# Altium project MMB_Controller.PrjPcb (part 1 of 4)
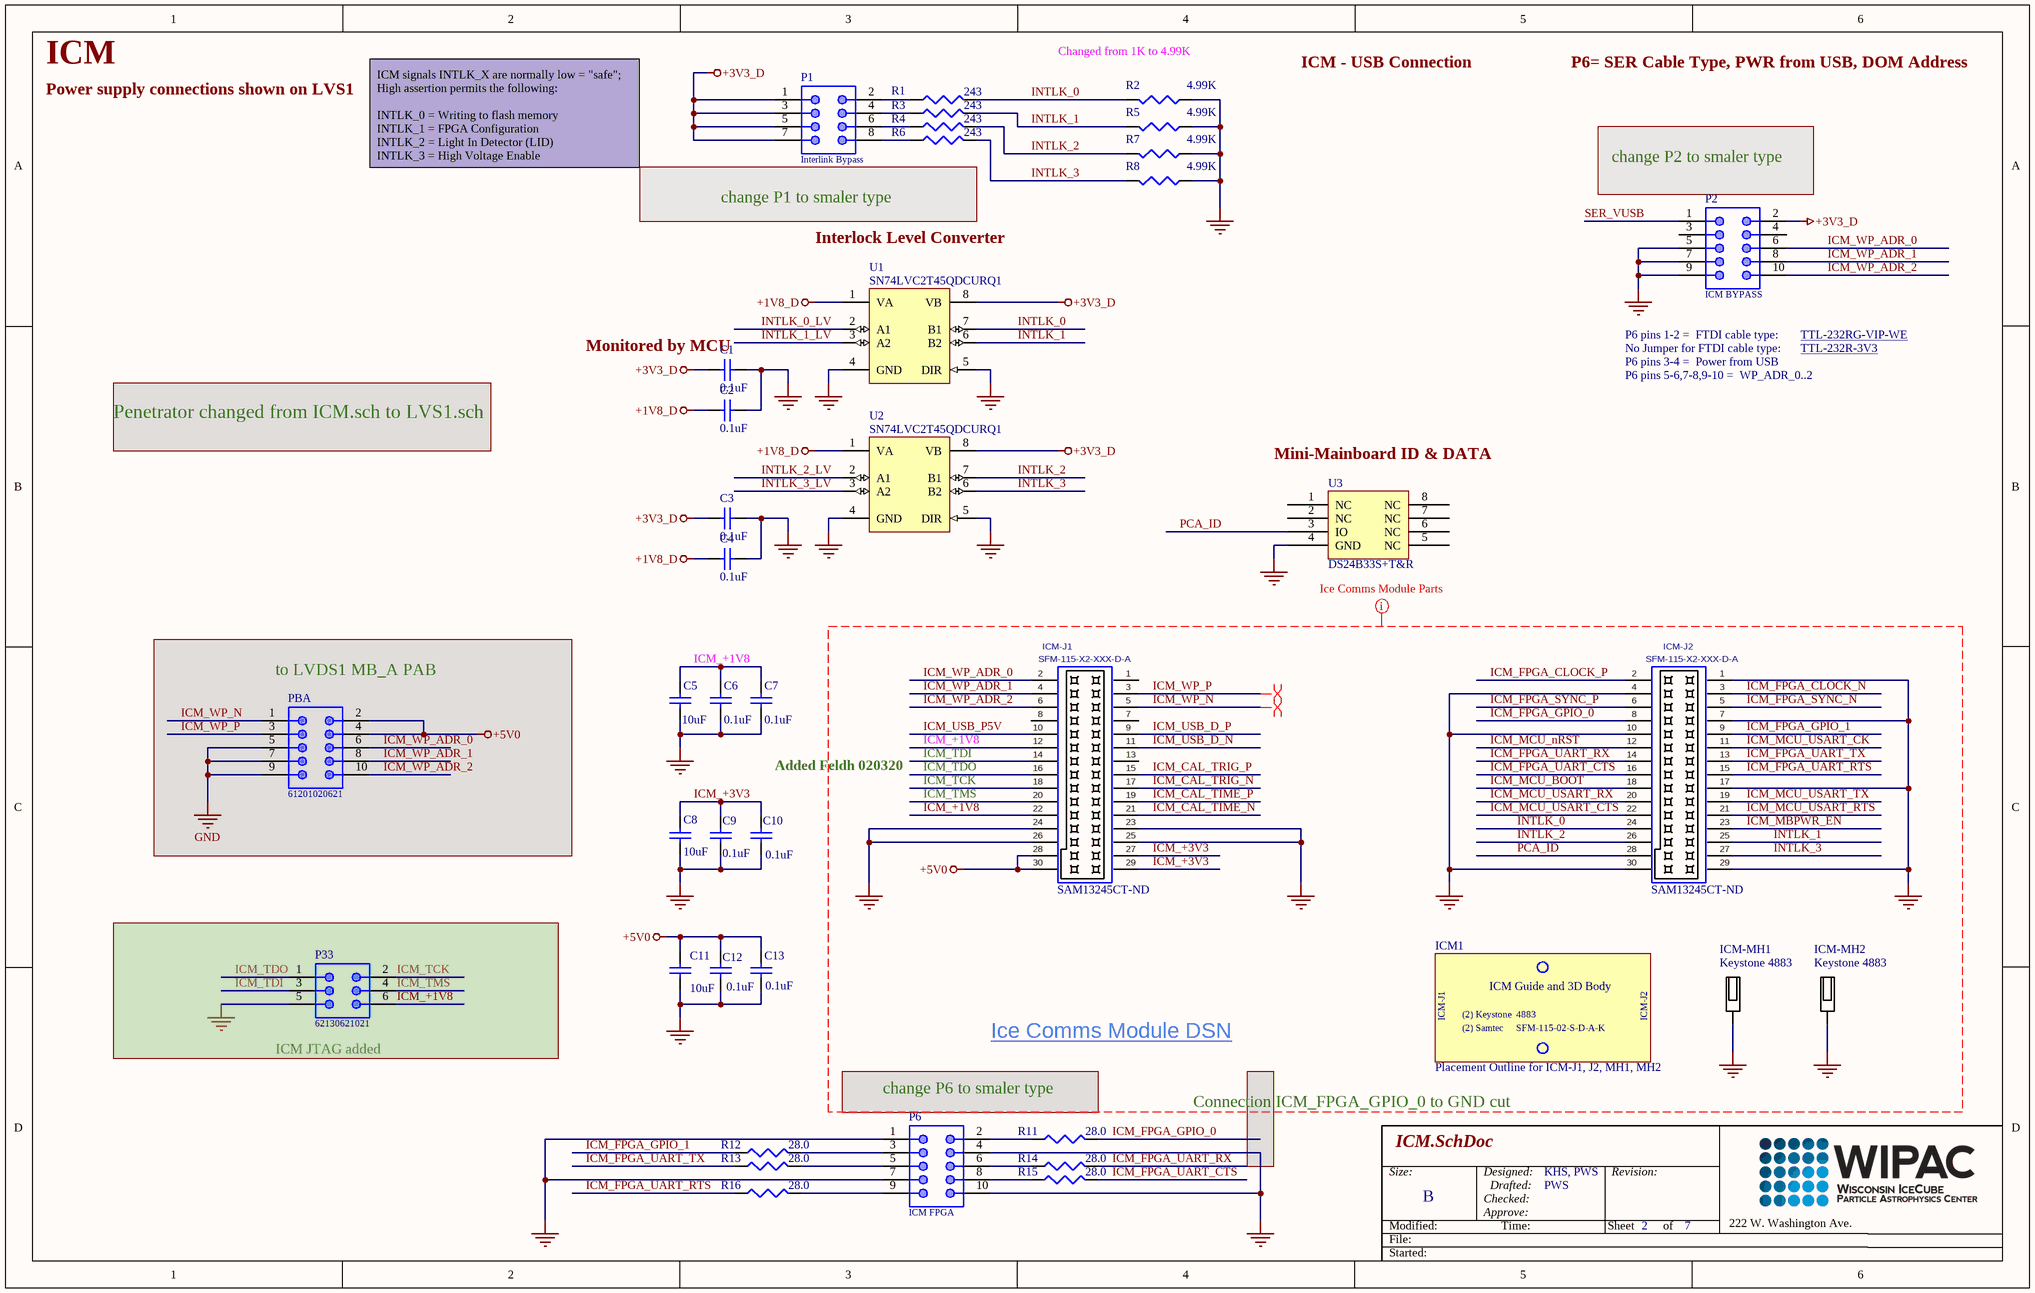
[diagram p0: ICM.SchDoc]
6 sheets, 252 parts. Net scope: global (net labels, ports and power ports of the same name join across sheets).
Board file: MMB_Controller_Board.pcbdoc
Sheets:
  ICM.SchDoc
  MCU.SchDoc
  PFIL.SchDoc
  SLO.SchDoc
  XTIO.SchDoc
  Revisions.SchDoc

## Sheet ICM.SchDoc
size B; DrawnBy: PWS; Engineer: KHS, PWS; Address1: 222 W. Washington Ave.; DocumentNumber: 2; Revision: 1; SheetNumber: 2; SheetTotal: 7

### Parts
C1  Capacitance: 0.1uF  [CAPC_0603]  (hidden comment: 0.1uF_603_50V)
C2  Capacitance: 0.1uF  [CAPC_0603]  (hidden comment: 0.1uF_603_50V)
C3  Capacitance: 0.1uF  [CAPC_0603]  (hidden comment: 0.1uF_603_50V)
C4  Capacitance: 0.1uF  [CAPC_0603]  (hidden comment: 0.1uF_603_50V)
C5  Capacitance: 10uF  [CAPC_0805]  (hidden comment: 10uF_805_10V)
C6  Capacitance: 0.1uF  [CAPC_0603]  (hidden comment: 0.1uF_603_50V)
C7  Capacitance: 0.1uF  [CAPC_0603]  (hidden comment: 0.1uF_603_50V)
C8  Capacitance: 10uF  [CAPC_0805]  (hidden comment: 10uF_805_10V)
C9  Capacitance: 0.1uF  [CAPC_0603]  (hidden comment: 0.1uF_603_50V)
C10  Capacitance: 0.1uF  [CAPC_0603]  (hidden comment: 0.1uF_603_50V)
C11  Capacitance: 10uF  [CAPC_0805]  (hidden comment: 10uF_805_10V)
C12  Capacitance: 0.1uF  [CAPC_0603]  (hidden comment: 0.1uF_603_50V)
C13  Capacitance: 0.1uF  [CAPC_0603]  (hidden comment: 0.1uF_603_50V)
ICM1  Placement Outline for ICM-J1, J2, MH1, MH2  [Ice Comms Module]
ICM-J1  SFM-115-X2-XXX-D-A  Supplier Part Number 1: SAM13245CT-ND  [SFM-115-X2-XXX-D-A]
ICM-J2  SFM-115-X2-XXX-D-A  Supplier Part Number 1: SAM13245CT-ND  [SFM-115-X2-XXX-D-A]
ICM-MH1  Keystone 4883  [Keystone 4883 solder]
ICM-MH2  Keystone 4883  [Keystone 4883 solder]
P1  Interlink Bypass  [62100821021]
P2  ICM BYPASS  [62101021021]
P6  ICM FPGA  [62101021021]
P33  62130621021  [62130621021]
PBA  61201020621  [61201020621]
R1  Resistance: 243  [RES_0603]  (hidden comment: R_243_603_1%)
R2  Resistance: 4.99K  [RES_0603]  (hidden comment: R_4.99K_603_1%)
R3  Resistance: 243  [RES_0603]  (hidden comment: R_243_603_1%)
R4  Resistance: 243  [RES_0603]  (hidden comment: R_243_603_1%)
R5  Resistance: 4.99K  [RES_0603]  (hidden comment: R_4.99K_603_1%)
R6  Resistance: 243  [RES_0603]  (hidden comment: R_243_603_1%)
R7  Resistance: 4.99K  [RES_0603]  (hidden comment: R_4.99K_603_1%)
R8  Resistance: 4.99K  [RES_0603]  (hidden comment: R_4.99K_603_1%)
R11  Resistance: 28.0  [RES_0603]  (hidden comment: R_28.0_603_1%)
R12  Resistance: 28.0  [RES_0603]  (hidden comment: R_28.0_603_1%)
R13  Resistance: 28.0  [RES_0603]  (hidden comment: R_28.0_603_1%)
R14  Resistance: 28.0  [RES_0603]  (hidden comment: R_28.0_603_1%)
R15  Resistance: 28.0  [RES_0603]  (hidden comment: R_28.0_603_1%)
R16  Resistance: 28.0  [RES_0603]  (hidden comment: R_28.0_603_1%)
U1  SN74LVC2T45QDCURQ1  [TI-DGK8_N]
U2  SN74LVC2T45QDCURQ1  [TI-DGK8_N]
U3  DS24B33S+T&R  [W8+2_M]

### Blocks framed on the sheet
to LVDS1 MB_A PAB: PBA
ICM JTAG added: P33

### Nets
+1V8_D: C2.2 C4.2 U1.1(VA) U2.1(VA)
+3V3_D: C1.2 C3.2 P1.1 P1.3 P1.5 P1.7 P2.2 U1.8(VB) U2.8(VB)
+5V0: C11.2 C12.2 C13.2 ICM-J1.28 ICM-J1.30 PBA.2 PBA.4
GND: C1.1 C2.1 C3.1 C4.1 C5.1 C6.1 C7.1 C8.1 C9.1 C10.1 C11.1 C12.1 C13.1 ICM-J1.23 ICM-J1.24 ICM-J1.25 ICM-J1.26 ICM-J2.1 ICM-J2.4 ICM-J2.7 ICM-J2.10 ICM-J2.17 ICM-J2.29 ICM-J2.30 ICM-MH1.1(Standoff) ICM-MH2.1(Standoff) P2.5 P2.7 P2.9 P6.1 P6.4 P6.7 P6.10 P33.5 PBA.5 PBA.7 PBA.9 R2.1 R5.1 R7.1 R8.1 U1.4(GND) U1.5(DIR) U2.4(GND) U2.5(DIR) U3.4(GND)
ICM_+1V8: C5.2 C6.2 C7.2 ICM-J1.12 ICM-J1.22 P33.6
ICM_+3V3: C8.2 C9.2 C10.2 ICM-J1.27 ICM-J1.29
ICM_CAL_TIME_N: ICM-J1.21
ICM_CAL_TIME_P: ICM-J1.19
ICM_CAL_TRIG_N: ICM-J1.17
ICM_CAL_TRIG_P: ICM-J1.15
ICM_FPGA_CLOCK_N: ICM-J2.3
ICM_FPGA_CLOCK_P: ICM-J2.2
ICM_FPGA_GPIO_0: ICM-J2.8 R11.2
ICM_FPGA_GPIO_1: ICM-J2.9 R12.1
ICM_FPGA_SYNC_N: ICM-J2.5
ICM_FPGA_SYNC_P: ICM-J2.6
ICM_FPGA_UART_CTS: ICM-J2.16 R15.2
ICM_FPGA_UART_RTS: ICM-J2.15 R16.1
ICM_FPGA_UART_RX: ICM-J2.14 R14.2
ICM_FPGA_UART_TX: ICM-J2.13 R13.1
ICM_MBPWR_EN: ICM-J2.23
ICM_MCU_BOOT: ICM-J2.18
ICM_MCU_nRST: ICM-J2.12
ICM_MCU_USART_CK: ICM-J2.11
ICM_MCU_USART_CTS: ICM-J2.22
ICM_MCU_USART_RTS: ICM-J2.21
ICM_MCU_USART_RX: ICM-J2.20
ICM_MCU_USART_TX: ICM-J2.19
ICM_TCK: ICM-J1.18 P33.2
ICM_TDI: ICM-J1.14 P33.3
ICM_TDO: ICM-J1.16 P33.1
ICM_TMS: ICM-J1.20 P33.4
ICM_USB_D_N: ICM-J1.11
ICM_USB_D_P: ICM-J1.9
ICM_USB_P5V: ICM-J1.10
ICM_WP_ADR_0: ICM-J1.2 P2.6 PBA.6
ICM_WP_ADR_1: ICM-J1.4 P2.8 PBA.8
ICM_WP_ADR_2: ICM-J1.6 P2.10 PBA.10
ICM_WP_N: ICM-J1.5 PBA.1
ICM_WP_P: ICM-J1.3 PBA.3
INTLK_0: ICM-J2.24 R1.2 R2.2 U1.7(B1)
INTLK_0_LV: U1.2(A1)
INTLK_1: ICM-J2.25 R3.2 R5.2 U1.6(B2)
INTLK_1_LV: U1.3(A2)
INTLK_2: ICM-J2.26 R4.2 R7.2 U2.7(B1)
INTLK_2_LV: U2.2(A1)
INTLK_3: ICM-J2.27 R6.2 R8.2 U2.6(B2)
INTLK_3_LV: U2.3(A2)
PCA_ID: ICM-J2.28 U3.3(IO)
SER_VUSB: P2.1
NetP1_2: P1.2 R1.1
NetP1_4: P1.4 R3.1
NetP1_6: P1.6 R4.1
NetP1_8: P1.8 R6.1
NetP6_2: P6.2 R11.1
NetP6_3: P6.3 R12.2
NetP6_5: P6.5 R13.2
NetP6_6: P6.6 R14.1
NetP6_8: P6.8 R15.1
NetP6_9: P6.9 R16.2

Not connected (* = marked no-connect by the designer): ICM-J1 1 7 8 13; P2 3 4; U3 1(NC) 2(NC) 5(NC) 6(NC) 7(NC) 8(NC)

### Layout directives
net class Ice Comms Module Parts: +5V0, GND, ICM_+1V8, ICM_+3V3, ICM_CAL_TIME_N, ICM_CAL_TIME_P, ICM_CAL_TRIG_N, ICM_CAL_TRIG_P, ICM_FPGA_CLOCK_N, ICM_FPGA_CLOCK_P, ICM_FPGA_GPIO_0, ICM_FPGA_GPIO_1, ICM_FPGA_SYNC_N, ICM_FPGA_SYNC_P, ICM_FPGA_UART_CTS, ICM_FPGA_UART_RTS, ICM_FPGA_UART_RX, ICM_FPGA_UART_TX, ICM_MBPWR_EN, ICM_MCU_BOOT, ICM_MCU_nRST, ICM_MCU_USART_CK, ICM_MCU_USART_CTS, ICM_MCU_USART_RTS, ICM_MCU_USART_RX, ICM_MCU_USART_TX, ICM_TCK, ICM_TDI, ICM_TDO, ICM_TMS, ICM_USB_D_N, ICM_USB_D_P, ICM_USB_P5V, ICM_WP_ADR_0, ICM_WP_ADR_1, ICM_WP_ADR_2, ICM_WP_N, ICM_WP_P, INTLK_0, INTLK_1, INTLK_2, INTLK_3, PCA_ID
differential pair: ICM_WP_N, ICM_WP_P

### Notes on the sheet
- ICM
- Power supply connections shown on LVS1
- (near R2) Changed from 1K to 4.99K
- ICM - USB Connection
- P6= SER Cable Type, PWR from USB, DOM Address
- ICM signals INTLK_X are normally low = "safe";
  High assertion permits the following:
  INTLK_0 = Writing to flash memory
  INTLK_1 = FPGA Configuration
  INTLK_2 = Light In Detector (LID)
  INTLK_3 = High Voltage Enable
- change P2 to smaler type
- change P1 to smaler type
- Interlock Level Converter
- (near C1) Monitored by MCU
- P6 pins 1-2 =  FTDI cable type:
- No Jumper for FTDI cable type:
- P6 pins 3-4 =  Power from USB
- TTL-232RG-VIP-WE
- TTL-232R-3V3
- Penetrator changed from ICM.sch to LVS1.sch
- P6 pins 5-6,7-8,9-10 =  WP_ADR_0..2
- (near U3) Mini-Mainboard ID & DATA
- Added Feldh 020320
- Ice Comms Module DSN
- change P6 to smaler type
- Connection ICM_FPGA_GPIO_0 to GND cut
- Size:
- Designed:
- Revision:
- Modified:
- File:
- B
- Checked:
- Approve:
- Drafted:
- Time:
- Sheet
- of
- Started:
- (in symbol Ice Comms Module) ICM Guide and 3D Body; ICM-J1; (2); Keystone; 4883; ICM-J2; Samtec; SFM-115-02-S-D-A-K

### Library data of the parts
C1-C4 = CapC_0.1uF_603_50V: 0.1µF ±10% 50V Ceramic Capacitor X7R 0603 (1608 Metric); Manufacturer: TDK; Manufacturer Part Number: CGJ3E2X7R1H104K080AA; Ratings: COTS; ComponentLink1Description: Datasheet; ComponentLink1URL: https://product.tdk.com/info/en/catalog/datasheets/mlcc_highreliability_general_en.pdf; ComponentLink2Description: Supplier Link; ComponentLink2URL: https://www.digikey.com/products/en?keywords=445-8122-1-ND; Supplier 1: Digi-Key; Stock 1: 697211; Pricing 1: 1 = 0.22000, 10 = 0.15300, 100 = 0.07740, 500 = 0.05294, 1000 = 0.04683 (USD); RoHS: Yes; Mount: Surface Mount; Case/Package: 0603; Weight: 7.1E-05oz; Case Code (Imperial): 0603; Case Code (Metric): 1608; Min Operating Temperature: -55°C; Max Operating Temperature: 125°C; Tolerance: 10%; Voltage Rating: 50V; Voltage Rating (DC): 50V; Packaging: Tape and Reel; Package Quantity: 1; Dielectric: X7R; Termination: SMD/SMT; Composition: Ceramic; Length: 1.6mm; Height: 0.8mm; Width: 0.8mm; Thickness: 0.035inch; Depth: 0.8mm; Radiation Hardening: No; Lead Free: Lead Free; Supplier Part Number 1: 445-8122-1-ND
C5 C8 C11 = CapC_10uF_805_10V: Capacitor; Manufacturer: Murata; Manufacturer Part Number: GCJ21BR71A106KE01L; Tolerance: 10%; Dielectric: X7R; Voltage Rating: 10V; Supplier 1: Digi-Key; Supplier Part Number 1: 490-12646-1-ND; RoHS: Yes; ComponentLink1URL: https://www.murata.com/~/media/webrenewal/support/library/catalog/products/capacitor/mlcc/c03e.ashx?la=en-us; ComponentLink1Description: Datasheet; Stock 1: 140399; Pricing 1: 1 = 0.70000, 10 = 0.49300, 100 = 0.32440, 500 = 0.24032, 1000 = 0.20428 (USD); ComponentLink2URL: https://www.digikey.com/products/en?keywords=490-12646-1-ND; ComponentLink2Description: Supplier Link; Mount: Surface Mount; Case/Package: 0805; Weight: 0.000335oz; Case Code (Metric): 2012; Case Code (Imperial): 0805; Min Operating Temperature: -55°C; Max Operating Temperature: 125°C; Packaging: Tape and Reel; Termination: SMD/SMT; Voltage Rating (DC): 10V; Package Quantity: 3000; Features: Soft Termination; Length: 2mm; Height: 1.25mm; Width: 0.049inch; Thickness: 0.057inch; Depth: 1.25mm; Ratings: AEC-Q200
C6 C7 C9 C10 C12 C13 = CapC_0.1uF_603_50V_GCJ: 0.1µF ±10% 50V Ceramic Capacitor X7R 0603 (1608 Metric); Manufacturer: Murata; Manufacturer Part Number: GCJ188R71H104KA12D; Supplier 1: Digi-Key; Supplier Part Number 1: 490-5798-1-ND; RoHS: Yes; Packaging: Tape and Reel; Tolerance: 10%; Ratings: AEC-Q200; ComponentLink1URL: https://psearch.en.murata.com/capacitor/product/GCJ188R71H104KA12%23.pdf; ComponentLink1Description: Datasheet; ComponentLink2Description: Supplier Link; ComponentLink2URL: https://www.digikey.com/products/en?keywords=490-5798-1-ND; Stock 1: 2321609; Pricing 1: 1=0.28000, 10=0.19200, 100=0.10890, 500=0.07686, 1000=0.06725 (USD); Mount: Surface Mount; Case/Package: 0603; Case Code (Imperial): 0603; Case Code (Metric): 1608; Min Operating Temperature: -55°C; Max Operating Temperature: 125°C; Voltage Rating: 50V; Dielectric: X7R; Termination: SMD/SMT; Voltage Rating (DC): 50V; Package Quantity: 1; Length: 1.6mm; Height: 0.8mm; Width: 0.031inch; Thickness: 0.035inch; Features: Soft Termination; Depth: 0.8mm; Radiation Hardening: No; Lead Free: Lead Free
ICM1 = Ice Comms Module: ComponentLink1Description: Ice Comms Module DSN; ComponentLink1URL: https://uwprod.sharepoint.com/:p:/r/sites/icecubeupgrade/CMS%20Docs/Ice%20Comms%20Module%20DSN.pptx?d=we6380014c53341de9c1ed9711f1badd4&csf=1&e=h81lgJ; Classname: ICM_3D
ICM-J1 ICM-J2 = SFM-115-X2-XXX-D-A: SOCKET STRIP, .050" (1.27mm) PITCH, SURFACE MOUNT.; Manufacturer: Samtec; Manufacturer Part Number: SFM-115-02-S-D-A-K-TR; Contact Resistance: 15mR; Connector Type: Receptacle,Socket; Number of Positions: 30; Gender: Receptacle; Max Voltage Rating (AC): 250V; Row Spacing: 0.05inch; Supplier 1: Digi-Key; RoHS: Yes; Stock 1: 1543; Pricing 1: 1 = 8.10000, 10 = 7.74400, 100 = 6.51200 (USD); Mount: Surface Mount; Contact Plating: Gold; Color: Black; Contact Material: Copper; Housing Color: Black; Housing Material: Polymer; Min Operating Temperature: -55°C; Max Operating Temperature: 125°C; Number of Rows: 2; Packaging: Tape and Reel; Termination: Solder; Number of Contacts: 30; Orientation: Straight; Length: 22.22mm; Pitch: 1.27mm; Depth: 3.68mm; Radiation Hardening: No; REACH SVHC: No SVHC; ComponentLink2Description: Supplier Link; ComponentLink2URL: https://www.digikey.com/products/en?keywords=SAM13245CT-ND; ComponentLink3Description: Datasheet; ComponentLink3URL: http://suddendocs.samtec.com/catalog_english/sfm.pdf; ComponentLink4Description: Drawing; ComponentLink4URL: http://suddendocs.samtec.com/prints/sfm-1xx-xx-xxx-d-xxx-mkt.pdf
ICM-MH1 ICM-MH2 = Keystone 4883: standoff, SMT, 4-40, 0.25" Long; Manufacturer: Keystone Electronics; Manufacturer Part Number: 4883; Supplier 1: Digi-Key; Stock 1: 8158; Pricing 1: 1 = 0.52000, 10 = 0.48500, 25 = 0.43640, 50 = 0.38780, 100 = 0.37170, 250 = 0.33932 (USD); Supplier Part Number 1: 36-4883CT-ND; ComponentLink1Description: 4883 Drawing; ComponentLink1URL: http://www.keyelco.com/product-pdf.cfm?p=14255; Classname: ICM_3D
P1 = 62100821021: WR-PHD Pin Header, SMT, pitch 1.27mm, Dual Row, Vertical, 8pin; Pin Number: 8; Gender: Male; Rated Current: 1A; Working Voltage: 100VAC; Withstanding Voltage: 500VAC; Contact Resistance: 20mOhm; ComponentLink1Description: Manufacturer; ComponentLink1URL: http://www.we-online.de; ComponentLink2Description: Datasheet; ComponentLink2URL: https://katalog.we-online.de/em/datasheet/62100821021.pdf; Part Number: 62100821021; Published Date: June 2019; Publisher: Wurth Elektronik; Pitch: 1.27mm; Operating Temperature: -40 to +105degC; Mounting Technology: SMT; Packaging: Tube; Row Number: Dual; Orientation: Vertical
P2 P6 = 62101021021: WR-PHD Pin Header, SMT, pitch 1.27mm, Dual Row, Vertical, 10pin; Pin Number: 10; Gender: Male; Rated Current: 1A; Working Voltage: 100VAC; Withstanding Voltage: 500VAC; Contact Resistance: 20mOhm; ComponentLink1Description: Manufacturer; ComponentLink1URL: http://www.we-online.de; ComponentLink2Description: Datasheet; ComponentLink2URL: https://katalog.we-online.de/em/datasheet/62101021021.pdf; Part Number: 62101021021; Published Date: June 2019; Publisher: Wurth Elektronik; Pitch: 1.27mm; Operating Temperature: -40 to +105degC; Mounting Technology: SMT; Packaging: Tube; Row Number: Dual; Orientation: Vertical
P33 = 62130621021: WR-PHD Pin Header, SMT, pitch 1.27mm, Dual Row, Vertical, 6pin; Pin Number: 6; Gender: Male; Rated Current: 1A; Working Voltage: 100VAC; Withstanding Voltage: 500VAC; Contact Resistance: 20mOhm; ComponentLink1Description: Manufacturer; ComponentLink1URL: http://www.we-online.de; ComponentLink2Description: Datasheet; ComponentLink2URL: https://katalog.we-online.de/em/datasheet/62130621021.pdf; Part Number: 62130621021; Published Date: June 2019; Publisher: Wurth Elektronik; Pitch: 1.27mm; Operating Temperature: -40 to +105degC; Mounting Technology: SMT; Packaging: Tape and Reel; Row Number: Dual; Orientation: Vertical
PBA = 61201020621: Male Box Header WR-BHD, SMT, Vertical, pitch 2.54 mm, 10 pins; Pitch: 2.54 mm; Working Voltage: 250 VAC; Withstanding Voltage: 500 VAC; Contact Resistance: 20 mOhm; Pin Number: 10; ComponentLink1Description: Manufacturer; ComponentLink1URL: http://www.we-online.de; ComponentLink2Description: Datasheet; ComponentLink2URL: https://katalog.we-online.de/em/datasheet/6120xx20621.pdf; Part Number: 61201020621; Published Date: August 2018; Publisher: Wurth Elektronik; Operating Temperature: -40 to 125 degC; Packaging: Tube; Gender: Male; Mounting Technology: SMT; Orientation: Vertical
R1 R3 R4 R6 = R_243_603_1%: RES 243 OHM 1/10W 1% 0603 SMD; Manufacturer: Panasonic; Manufacturer Part Number: ERJ3EKF2430V; Power Rating: 100mW; Voltage Rating: 75V; Temperature Coefficient: 100ppm/°C; Voltage Rating (DC): 50V; Supplier 1: Digi-Key; Stock 1: 188850; Pricing 1: 1 = 0.10000, 10 = 0.06500, 100 = 0.02640, 1000 = 0.01186, 2500 = 0.01029 (USD); RoHS: Yes; Mount: Surface Mount; Case/Package: 0603; Case Code (Metric): 1608; Case Code (Imperial): 0603; Contact Plating: Tin; Min Operating Temperature: -55°C; Max Operating Temperature: 155°C; Packaging: Tape and Reel; Tolerance: 1%; Package Quantity: 1; Composition: Thick Film; Number of Terminations: 2; Military Standard: Not; Max Power Dissipation: 100mW; Features: Automotive AEC-Q200; Termination: SMD/SMT; Length: 1.6mm; Height: 0.45mm; Width: 0.031inch; Depth: 0.8mm; Radiation Hardening: No; REACH SVHC: Unknown; Lead Free: Lead Free; ComponentLink1URL: https://datasheet.ciiva.com/34303/1987812-34303583.pdf?src-supplier=Jameco; ComponentLink1Description: https://datasheet.ciiva.com/34303/1987812-34303583.pdf?src-supplier=Jameco; ComponentLink2URL: https://datasheet.ciiva.com/16775/70260748-16775483.pdf?src-supplier=Allied+Electronics; ComponentLink2Description: https://datasheet.ciiva.com/16775/70260748-16775483.pdf?src-supplier=Allied+Electronics; ComponentLink3URL: https://datasheet.ciiva.com/15158/getdatasheetpartid-248556-15158988.pdf?src-supplier=Verical; ComponentLink3Description: https://datasheet.ciiva.com/15158/getdatasheetpartid-248556-15158988.pdf?src-supplier=Verical; ComponentLink4URL: https://datasheet.ciiva.com/46377/426256-46377740.pdf?src-supplier=Element14; ComponentLink4Description: https://datasheet.ciiva.com/46377/426256-46377740.pdf?src-supplier=Element14; ComponentLink5URL: https://datasheet.ciiva.com/5870/426256-5870797.pdf?src-supplier=Farnell; ComponentLink5Description: https://datasheet.ciiva.com/5870/426256-5870797.pdf?src-supplier=Farnell; ComponentLink6URL: https://datasheet.ciiva.com/24069/aoa0000ce2-24069038.pdf?src-supplier=Mouser; ComponentLink6Description: https://datasheet.ciiva.com/24069/aoa0000ce2-24069038.pdf?src-supplier=Mouser; ComponentLink7URL: https://datasheet.ciiva.com/28685/1678782-28685326.pdf?src-supplier=Element14; ComponentLink7Description: https://datasheet.ciiva.com/28685/1678782-28685326.pdf?src-supplier=Element14; ComponentLink8URL: https://datasheet.ciiva.com/46389/426256-46389230.pdf?src-supplier=Element14; ComponentLink8Description: https://datasheet.ciiva.com/46389/426256-46389230.pdf?src-supplier=Element14; Supplier Part Number 1: P243HCT-ND
R2 R5 R7 R8 = R_4.99K_603_1%: RES 4.99K OHM 1/10W 1% 0603 SMD; Manufacturer: Panasonic; Manufacturer Part Number: ERJ3EKF4991V; Temperature Coefficient: 100ppm/°C; Power Rating: 100mW; Voltage Rating: 22.34V; Voltage Rating (DC): 50V; Supplier 1: Digi-Key; Supplier Part Number 1: P4.99KHCT-ND; RoHS: Yes; Packaging: Tape and Reel; Tolerance: 1%; Composition: Thick Film; Features: Automotive AEC-Q200; Height: 0.022inch; Number of Terminations: 2; ComponentLink1URL: https://datasheet.ciiva.com/6064/1678796-6064566.pdf?src-supplier=Farnell; ComponentLink1Description: https://datasheet.ciiva.com/6064/1678796-6064566.pdf?src-supplier=Farnell; Stock 1: 2729693; Pricing 1: 1 = 0.10000, 10 = 0.06500, 100 = 0.02640, 1000 = 0.01186, 2500 = 0.01029 (USD); Mount: Surface Mount; Case/Package: 0603; Contact Plating: Tin; Case Code (Metric): 1608; Case Code (Imperial): 0603; Min Operating Temperature: -55°C; Max Operating Temperature: 155°C; Package Quantity: 1; Termination: SMD/SMT; Military Standard: Not; Max Power Dissipation: 100mW; Length: 1.6mm; Width: 0.031inch; Depth: 0.8mm; Radiation Hardening: No; REACH SVHC: No SVHC; Lead Free: Lead Free; ComponentLink2URL: https://datasheet.ciiva.com/16514/aoa0000ce2-16514087.pdf?src-supplier=Avnet+Asia; ComponentLink2Description: https://datasheet.ciiva.com/16514/aoa0000ce2-16514087.pdf?src-supplier=Avnet+Asia; ComponentLink3URL: https://datasheet.ciiva.com/22749/1678782-22749655.pdf?src-supplier=Element14; ComponentLink3Description: https://datasheet.ciiva.com/22749/1678782-22749655.pdf?src-supplier=Element14; ComponentLink4URL: https://datasheet.ciiva.com/24068/aoa0000ce2-24068247.pdf?src-supplier=Mouser; ComponentLink4Description: https://datasheet.ciiva.com/24068/aoa0000ce2-24068247.pdf?src-supplier=Mouser; ComponentLink5URL: https://datasheet.ciiva.com/48531/aoa0000ce2-48531015.pdf?src-supplier=Avnet; ComponentLink5Description: https://datasheet.ciiva.com/48531/aoa0000ce2-48531015.pdf?src-supplier=Avnet; ComponentLink6URL: https://datasheet.ciiva.com/16767/70260748-16767032.pdf?src-supplier=Allied+Electronics; ComponentLink6Description: https://datasheet.ciiva.com/16767/70260748-16767032.pdf?src-supplier=Allied+Electronics; ComponentLink7URL: https://datasheet.ciiva.com/28694/1678782-28694217.pdf?src-supplier=Element14; ComponentLink7Description: https://datasheet.ciiva.com/28694/1678782-28694217.pdf?src-supplier=Element14; ComponentLink8URL: https://datasheet.ciiva.com/30108/aoa0000ce2-30108827.pdf?src-supplier=Onlinecomponents.com; ComponentLink8Description: https://datasheet.ciiva.com/30108/aoa0000ce2-30108827.pdf?src-supplier=Onlinecomponents.com; ComponentLink9URL: https://datasheet.ciiva.com/9117/aoa0000ce2-9117117.pdf?src-supplier=Avnet; ComponentLink9Description: https://datasheet.ciiva.com/9117/aoa0000ce2-9117117.pdf?src-supplier=Avnet; ComponentLink10URL: https://datasheet.ciiva.com/46376/1678796-46376941.pdf?src-supplier=Element14; ComponentLink10Description: https://datasheet.ciiva.com/46376/1678796-46376941.pdf?src-supplier=Element14
R11-R16 = R_28.0_603_1%: RES 28.0 OHM 1/10W 1% 0603 SMD; Manufacturer: Panasonic; Manufacturer Part Number: ERJ3EKF28R0V; Power Rating: 100mW; Voltage Rating: 75V; Temperature Coefficient: 100ppm/°C; Voltage Rating (DC): 50V; Supplier 1: Digi-Key; Stock 1: 75130; Pricing 1: 1 = 0.10000, 10 = 0.06500, 100 = 0.02640, 1000 = 0.01186, 2500 = 0.01029 (USD); RoHS: Yes; Mount: Surface Mount; Case/Package: 0603; Case Code (Imperial): 0603; Case Code (Metric): 1608; Contact Plating: Tin; Min Operating Temperature: -55°C; Max Operating Temperature: 155°C; Tolerance: 1%; Package Quantity: 1; Packaging: Tape and Reel; Composition: Thick Film; Number of Terminations: 2; Max Power Dissipation: 100mW; Features: Automotive AEC-Q200; Length: 1.6mm; Height: 0.022inch; Width: 0.8mm; Radiation Hardening: No; REACH SVHC: Yes; Lead Free: Lead Free; ComponentLink1URL: https://datasheet.ciiva.com/46437/1678782-46437594.pdf?src-supplier=Element14; ComponentLink1Description: https://datasheet.ciiva.com/46437/1678782-46437594.pdf?src-supplier=Element14; ComponentLink2URL: https://datasheet.ciiva.com/22676/1678782-22676667.pdf?src-supplier=Element14; ComponentLink2Description: https://datasheet.ciiva.com/22676/1678782-22676667.pdf?src-supplier=Element14; ComponentLink3URL: https://datasheet.ciiva.com/22736/1678782-22736555.pdf?src-supplier=Element14; ComponentLink3Description: https://datasheet.ciiva.com/22736/1678782-22736555.pdf?src-supplier=Element14; Supplier Part Number 1: P28.0HCT-ND
U1 U2 = SN74LVC2T45QDCURQ1: Voltage Level Translator Bidirectional 1 Circuit 2 Channel 420Mbps SM8 (SSOP); Generic Part Number: SN74LVC2T45-Q1; Manufacturer: Texas Instruments; Manufacturer Part Number: SN74LVC2T45MDCTTEP; VCC(Min)(V): 1.65; VCC(Max)(V): 5.5; Output Type: CMOS; Logic: True; ICC @ Nom Voltage(Max)(mA): 0.004; Input Type: CMOS/TTL; Bits(#): 2; F @ Nom Voltage(Max)(Mhz): 150; Rating: Automotive; Technology Family: LVC; Voltage(Nom)(V): 1.8,2.5,3.3,5; Schmitt Trigger: No; Output Drive (IOL/IOH)(Max)(mA): 32/-32; Sub-Family: Dual Supply Translator; 3-State Output: Yes; tpd @ Nom Voltage(Max)(ns): 19.5,12,9.6,8.4; Max Supply Voltage: 5.5V; Min Supply Voltage: 1.65V; Propagation Delay: 3.5ns; Output Current: 32mA; Number of Elements: 1; Turn-On Delay Time: 53.2ns; Polarity: Non-Inverting; High Level Output Current: -32mA; Quiescent Current: 12mA; DatasheetVersion: SCES818; PackageReference: DCU0008A; Operating Temperature Range(C): -40 to 125; PartNumber: SN74LVC2T45QDCURQ1; ComponentLink1Description: Manufacturer URL; ComponentLink1URL: http://www.ti.com/; ComponentLink2Description: Datasheet; ComponentLink2URL: http://www.ti.com/lit/ds/symlink/sn74lvc2t45-q1.pdf; Supplier 1: Digi-Key; Stock 1: 5778; Pricing 1: 1 = 1.67000, 10 = 1.50100, 100 = 1.20660 (USD); RoHS: Yes; Mount: Surface Mount; Case/Package: SSOP; Number of Pins: 8; Weight: 0.000825oz; Contact Plating: Gold; Min Operating Temperature: -55°C; Max Operating Temperature: 125°C; Packaging: Tape and Reel; Package Quantity: 250; Number of Channels: 2; Data Rate: 420Mbps; Number of Inputs: 2; Direction: Bidirectional; Logic Function: Translator; Number of Bits: 2; Low Level Output Current: 32mA; Radiation Hardening: No; REACH SVHC: No SVHC; Lead Free: Lead Free; ComponentLink3URL: https://datasheet.ciiva.com/14316/sn74lvc2t45-ep-14316386.pdf?src-supplier=Avnet; ComponentLink3Description: https://datasheet.ciiva.com/14316/sn74lvc2t45-ep-14316386.pdf?src-supplier=Avnet; ComponentLink4URL: https://datasheet.ciiva.com/15086/getdatasheetpartid-144548-15086248.pdf?src-supplier=Verical; ComponentLink4Description: https://datasheet.ciiva.com/15086/getdatasheetpartid-144548-15086248.pdf?src-supplier=Verical; ComponentLink5URL: https://datasheet.ciiva.com/1899/sn74lvc2t45-ep-1899619.pdf?src-supplier=Digi-Key; ComponentLink5Description: https://datasheet.ciiva.com/1899/sn74lvc2t45-ep-1899619.pdf?src-supplier=Digi-Key; ComponentLink6URL: https://datasheet.ciiva.com/1899/sn74lvc2t45-ep-1899620.pdf?src-supplier=Digi-Key; ComponentLink6Description: https://datasheet.ciiva.com/1899/sn74lvc2t45-ep-1899620.pdf?src-supplier=Digi-Key; ComponentLink7URL: https://datasheet.ciiva.com/1899/sn74lvc2t45-ep-1899621.pdf?src-supplier=Digi-Key; ComponentLink7Description: https://datasheet.ciiva.com/1899/sn74lvc2t45-ep-1899621.pdf?src-supplier=Digi-Key; ComponentLink8URL: https://datasheet.ciiva.com/48701/001073867-da-01-en-ic-bus-trans-sn74lvc2t45mdcttep-sm-8-tid-48701957.pdf?src-supplier=Conrad; ComponentLink8Description: https://datasheet.ciiva.com/48701/001073867-da-01-en-ic-bus-trans-sn74lvc2t45mdcttep-sm-8-tid-48701957.pdf?src-supplier=Conrad; Supplier Part Number 1: 296-23952-1-ND
U3 = DS24B33S+T&R: EEPROM Memory IC 4Kb (256 x 16) 1-Wire®  2µs 8-SO; Manufacturer: Maxim; Interface: Serial; Min Supply Voltage: 2.8V; Max Supply Voltage: 5.25V; ComponentLink1Description: Digi-Key Link; ComponentLink1URL: https://www.digikey.com/product-detail/en/maxim-integrated/DS24B33S-T-R/DS24B33S-T-RCT-ND/3877655; ComponentLink2Description: Datasheet; ComponentLink2URL: https://datasheets.maximintegrated.com/en/ds/DS24B33.pdf; Supplier 1: Digi-Key; Manufacturer Part Number: DS24B33S+T&R; Stock 1: 50740; Pricing 1: 1 = 3.56000, 10 = 3.20200, 25 = 3.15120, 50 = 3.14260, 100 = 2.80810, 250 = 2.71688, 500 = 2.70674, 1000 = 2.52088 (USD); RoHS: Yes; Case/Package: SOIC; Number of Pins: 8; Contact Plating: Tin; Min Operating Temperature: -40°C; Max Operating Temperature: 85°C; Packaging: Tape and Reel; Package Quantity: 1; Density: 4Kb; Memory Type: EEPROM; Memory Size: 4Kb; Radiation Hardening: No; REACH SVHC: Unknown; ComponentLink3URL: http://www.mouser.com/ds/2/256/DS24B33-87042.pdf?src-supplier=Mouser; ComponentLink3Description: http://www.mouser.com/ds/2/256/DS24B33-87042.pdf?src-supplier=Mouser; ComponentLink4URL: http://www.farnell.com/datasheets/2001215.pdf?src-supplier=Farnell; ComponentLink4Description: http://www.farnell.com/datasheets/2001215.pdf?src-supplier=Farnell; ComponentLink5URL: https://produktinfo.conrad.com/datenblaetter/1100000-1199999/001121821-da-01-en-IC_EEPROM_4KBIT_DS24B33S_T_R_SOIC_8_MAX.pdf?src-supplier=Conrad; ComponentLink5Description: https://produktinfo.conrad.com/datenblaetter/1100000-1199999/001121821-da-01-en-IC_EEPROM_4KBIT_DS24B33S_T_R_SOIC_8_MAX.pdf?src-supplier=Conrad; ComponentLink6URL: http://datasheets.maximintegrated.com/en/ds/DS24B33.pdf?src-supplier=Avnet; ComponentLink6Description: http://datasheets.maximintegrated.com/en/ds/DS24B33.pdf?src-supplier=Avnet; ComponentLink7URL: http://datasheets.maximintegrated.com/en/ds/DS24B33.pdf?src-supplier=Avnet+Europe; ComponentLink7Description: http://datasheets.maximintegrated.com/en/ds/DS24B33.pdf?src-supplier=Avnet+Europe; ComponentLink8URL: http://datasheets.maximintegrated.com/en/ds/DS24B33.pdf?src-supplier=Digi-Key; ComponentLink8Description: http://datasheets.maximintegrated.com/en/ds/DS24B33.pdf?src-supplier=Digi-Key; ComponentLink9URL: https://datasheets.maximintegrated.com/en/ds/DS24B33.pdf?src-supplier=Digi-Key; ComponentLink9Description: https://datasheets.maximintegrated.com/en/ds/DS24B33.pdf?src-supplier=Digi-Key; ComponentLink10URL: http://www.farnell.com/datasheets/2001215.pdf?src-supplier=Element14; ComponentLink10Description: http://www.farnell.com/datasheets/2001215.pdf?src-supplier=Element14; ComponentLink11URL: http://www.maximintegrated.com/DS24B33.pdf?src-supplier=Avnet+Asia; ComponentLink11Description: http://www.maximintegrated.com/DS24B33.pdf?src-supplier=Avnet+Asia; Supplier Part Number 1: DS24B33S+T&RCT-ND